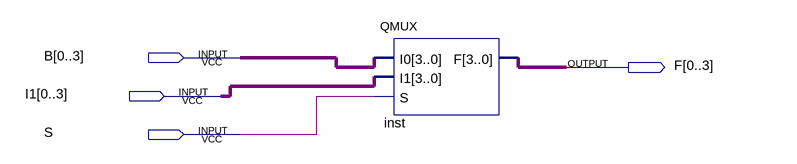
[diagram p0: schematic sheet]
// Quartus schematic Block_for_MUXQ.bdf as structural Verilog: 1 symbols, 4 pins
module Block_for_MUXQ (
  input  [0:3] B,
  input  [0:3] I1,
  input  S,
  output [0:3] F
);

  QMUX inst (.I0(B), .I1(I1), .S(S), .F(F));
endmodule
